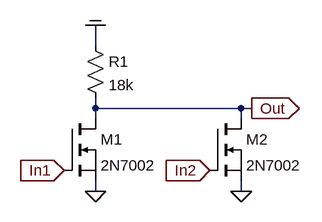
[diagram p0: schematic nor.asc]
nor.asc, the LTspice schematic file:
Version 4
SHEET 1 880 680
WIRE 224 32 224 0
WIRE 224 128 224 112
WIRE 448 128 224 128
WIRE 464 128 448 128
WIRE 224 144 224 128
WIRE 448 144 448 128
WIRE 224 256 224 240
WIRE 448 256 448 240
FLAG 176 224 In1
IOPIN 176 224 In
FLAG 464 128 Out
IOPIN 464 128 Out
FLAG 224 0 COM
FLAG 448 256 0
FLAG 400 224 In2
IOPIN 400 224 In
FLAG 224 256 0
SYMBOL nmos 176 144 R0
SYMATTR InstName M1
SYMATTR Value 2N7002
SYMBOL res 208 16 R0
SYMATTR InstName R1
SYMATTR Value 18k
SYMBOL nmos 400 144 R0
SYMATTR InstName M2
SYMATTR Value 2N7002

The netlist it stands for:
* nor.asc
M1 Out In1 0 0 2N7002
R1 COM Out 18k
M2 Out In2 0 0 2N7002
.model NMOS NMOS
.model PMOS PMOS
.lib standard.mos
.backanno
.end